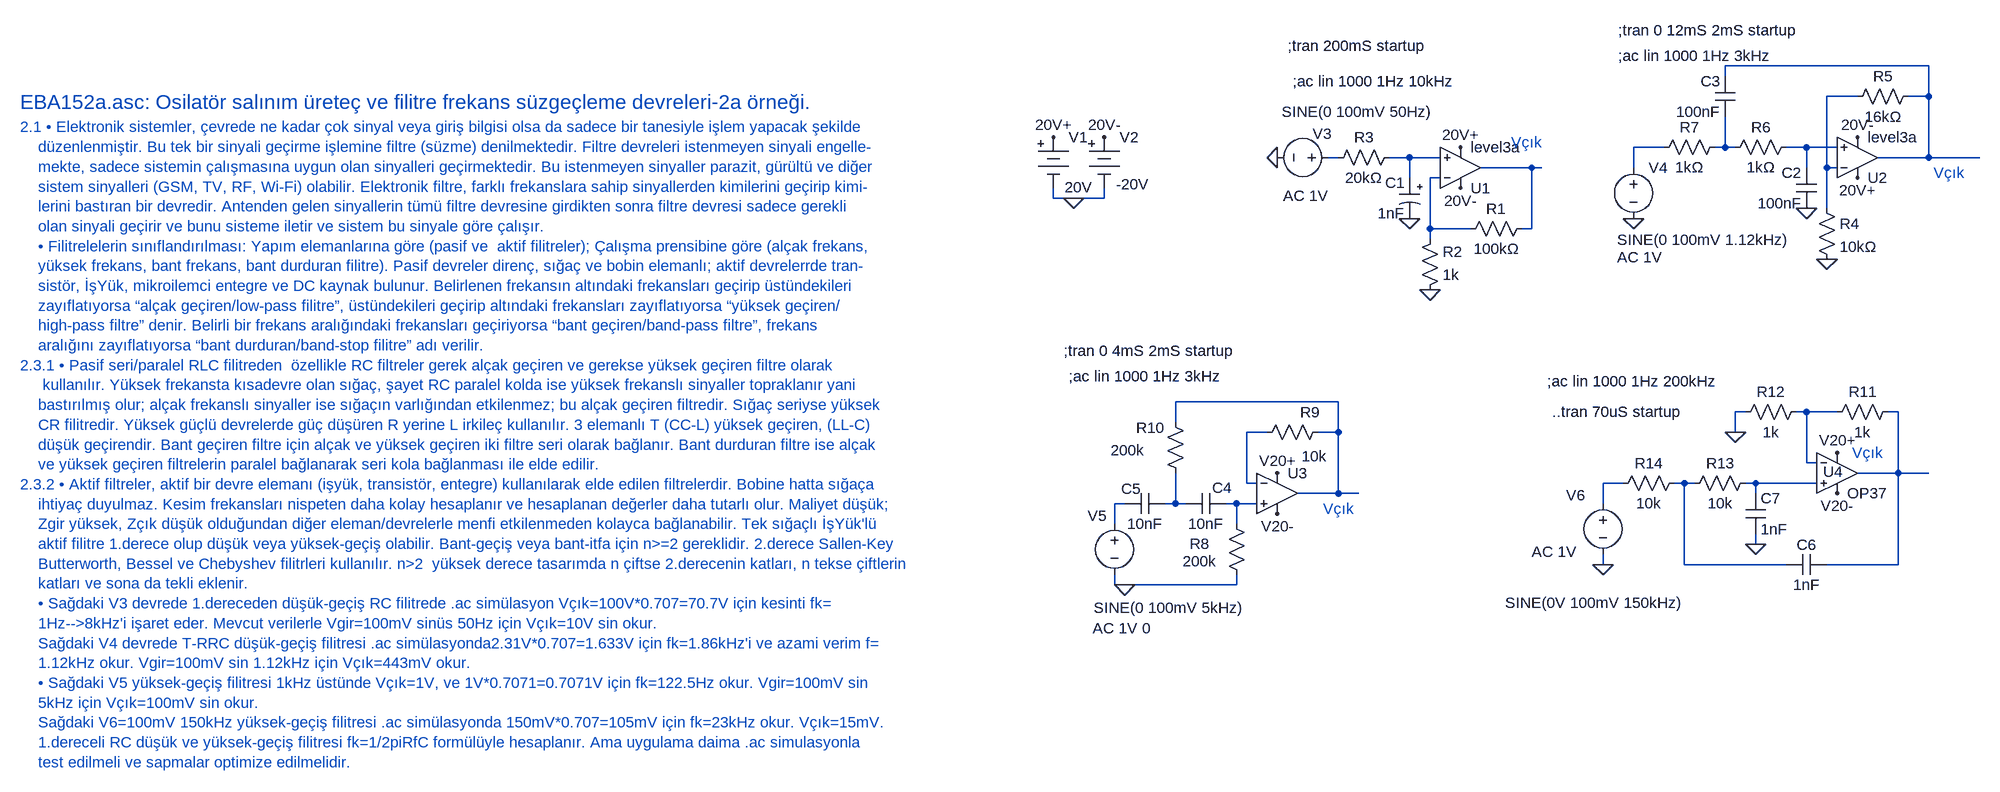
[diagram p0: schematic EBA152a.asc]
EBA152a.asc, the LTspice schematic file:
Version 4
SHEET 1 6044 4332
WIRE 2768 0 2448 0
WIRE 2448 16 2448 0
WIRE 2656 48 2608 48
WIRE 2768 48 2768 0
WIRE 2768 48 2736 48
WIRE 2352 128 2304 128
WIRE 2448 128 2448 80
WIRE 2448 128 2432 128
WIRE 2464 128 2448 128
WIRE 2576 128 2544 128
WIRE 2624 128 2576 128
WIRE 1840 144 1824 144
WIRE 1952 144 1920 144
WIRE 2000 144 1952 144
WIRE 2768 144 2768 48
WIRE 2768 144 2688 144
WIRE 2848 144 2768 144
WIRE 2144 160 2064 160
WIRE 2160 160 2144 160
WIRE 2304 160 2304 128
WIRE 2576 160 2576 128
WIRE 2608 160 2608 48
WIRE 2624 160 2608 160
WIRE 1952 176 1952 144
WIRE 2000 176 1984 176
WIRE 1392 208 1392 192
WIRE 1424 208 1392 208
WIRE 1472 208 1472 192
WIRE 1472 208 1424 208
WIRE 2608 224 2608 160
WIRE 1984 256 1984 176
WIRE 2048 256 1984 256
WIRE 2144 256 2144 160
WIRE 2144 256 2128 256
WIRE 1984 272 1984 256
WIRE 1840 528 1584 528
WIRE 2480 544 2464 544
WIRE 2576 544 2560 544
WIRE 2624 544 2576 544
WIRE 2720 544 2704 544
WIRE 1584 560 1584 528
WIRE 1728 576 1696 576
WIRE 1840 576 1840 528
WIRE 1840 576 1808 576
WIRE 2464 576 2464 544
WIRE 2576 624 2576 544
WIRE 2592 624 2576 624
WIRE 2720 640 2720 544
WIRE 2720 640 2656 640
WIRE 2768 640 2720 640
WIRE 1696 656 1696 576
WIRE 1712 656 1696 656
WIRE 2288 656 2256 656
WIRE 2384 656 2368 656
WIRE 2400 656 2384 656
WIRE 2496 656 2480 656
WIRE 2592 656 2496 656
WIRE 1840 672 1840 576
WIRE 1840 672 1776 672
WIRE 1872 672 1840 672
WIRE 2496 672 2496 656
WIRE 1504 688 1488 688
WIRE 1584 688 1584 640
WIRE 1584 688 1568 688
WIRE 1600 688 1584 688
WIRE 1680 688 1664 688
WIRE 1712 688 1680 688
WIRE 2256 688 2256 656
WIRE 1488 720 1488 688
WIRE 1680 720 1680 688
WIRE 2496 752 2496 736
WIRE 2256 784 2256 768
WIRE 2384 784 2384 656
WIRE 2544 784 2384 784
WIRE 2720 784 2720 640
WIRE 2720 784 2608 784
WIRE 1488 816 1488 800
WIRE 1504 816 1488 816
WIRE 1680 816 1680 800
WIRE 1680 816 1504 816
FLAG 1424 208 0
FLAG 1392 112 20V+
FLAG 1472 112 20V-
FLAG 1984 352 0
FLAG 1952 240 0
FLAG 1744 144 0
FLAG 2656 112 20V-
FLAG 2656 176 20V+
FLAG 2608 304 0
FLAG 2576 224 0
FLAG 2304 240 0
FLAG 1504 816 0
FLAG 1744 640 V20+
FLAG 1744 704 V20-
FLAG 2032 128 20V+
FLAG 2032 192 20V-
FLAG 2464 576 0
FLAG 2256 784 0
FLAG 2496 752 0
FLAG 2624 608 V20+
FLAG 2624 672 V20-
SYMBOL Misc\\battery 1392 96 R0
WINDOW 3 18 95 Left 2
SYMATTR Value 20V
SYMATTR InstName V1
SYMBOL Misc\\battery 1472 96 R0
WINDOW 3 19 90 Left 2
SYMATTR Value -20V
SYMATTR InstName V2
SYMBOL res 2144 240 R90
WINDOW 0 0 56 VBottom 2
WINDOW 3 32 56 VTop 2
SYMATTR InstName R1
SYMATTR Value 100kΩ
SYMBOL res 1968 368 M180
WINDOW 0 36 76 Left 2
WINDOW 3 36 40 Left 2
SYMATTR InstName R2
SYMATTR Value 1k
SYMBOL OpAmps\\UniversalOpAmp3 2032 160 M180
SYMATTR InstName U1
SYMBOL polcap 1968 176 M0
SYMATTR InstName C1
SYMATTR Value 1nF
SYMBOL res 1936 128 R90
WINDOW 0 0 56 VBottom 2
WINDOW 3 32 56 VTop 2
SYMATTR InstName R3
SYMATTR Value 20kΩ
SYMBOL voltage 1840 144 R90
WINDOW 0 -37 11 VRight 2
WINDOW 3 -72 -143 VRight 2
WINDOW 123 60 18 VRight 2
WINDOW 39 0 0 Left 0
SYMATTR InstName V3
SYMATTR Value SINE(0 100mV 50Hz)
SYMATTR Value2 AC 1V
SYMBOL OpAmps\\UniversalOpAmp3 2656 144 M180
SYMATTR InstName U2
SYMBOL res 2592 208 R0
SYMATTR InstName R4
SYMATTR Value 10kΩ
SYMBOL res 2752 32 R90
WINDOW 0 0 56 VBottom 2
WINDOW 3 32 56 VTop 2
SYMATTR InstName R5
SYMATTR Value 16kΩ
SYMBOL cap 2592 160 M0
SYMATTR InstName C2
SYMATTR Value 100nF
SYMBOL res 2560 112 R90
WINDOW 0 0 56 VBottom 2
WINDOW 3 32 56 VTop 2
SYMATTR InstName R6
SYMATTR Value 1kΩ
SYMBOL res 2448 112 R90
WINDOW 0 0 56 VBottom 2
WINDOW 3 32 56 VTop 2
SYMATTR InstName R7
SYMATTR Value 1kΩ
SYMBOL cap 2464 16 M0
SYMATTR InstName C3
SYMATTR Value 100nF
SYMBOL voltage 2304 144 R0
WINDOW 123 -26 157 Left 2
WINDOW 39 0 0 Left 0
WINDOW 3 -26 129 Left 2
SYMATTR Value2 AC 1V
SYMATTR Value SINE(0 100mV 1.12kHz)
SYMATTR InstName V4
SYMBOL voltage 1488 704 R0
WINDOW 0 -42 3 Left 2
WINDOW 123 -34 180 Left 2
WINDOW 39 0 0 Left 0
WINDOW 3 -33 148 Left 2
SYMATTR InstName V5
SYMATTR Value2 AC 1V 0
SYMATTR Value SINE(0 100mV 5kHz)
SYMBOL res 1664 704 R0
WINDOW 0 -58 47 Left 2
WINDOW 3 -69 75 Left 2
SYMATTR InstName R8
SYMATTR Value 200k
SYMBOL cap 1600 704 R270
WINDOW 0 25 57 VTop 2
WINDOW 3 0 32 VBottom 2
SYMATTR InstName C4
SYMATTR Value 10nF
SYMBOL OpAmps\\UniversalOpamp2 1744 672 R0
SYMATTR InstName U3
SYMBOL res 1712 592 R270
WINDOW 0 32 83 VTop 2
WINDOW 3 -6 90 VBottom 2
SYMATTR InstName R9
SYMATTR Value 10k
SYMBOL res 1568 544 R0
WINDOW 0 -46 25 Left 2
WINDOW 3 -86 60 Left 2
SYMATTR InstName R10
SYMATTR Value 200k
SYMBOL cap 1504 704 R270
WINDOW 0 24 10 VTop 2
WINDOW 3 0 32 VBottom 2
SYMATTR InstName C5
SYMATTR Value 10nF
SYMBOL Opamps\\OP37 2624 576 R0
WINDOW 0 -22 62 Left 2
SYMATTR InstName U4
SYMBOL res 2720 528 R90
WINDOW 0 0 56 VBottom 2
WINDOW 3 32 56 VTop 2
SYMATTR InstName R11
SYMATTR Value 1k
SYMBOL res 2576 528 R90
WINDOW 0 0 56 VBottom 2
WINDOW 3 32 56 VTop 2
SYMATTR InstName R12
SYMATTR Value 1k
SYMBOL cap 2608 768 R90
WINDOW 0 0 32 VBottom 2
WINDOW 3 32 32 VTop 2
SYMATTR InstName C6
SYMATTR Value 1nF
SYMBOL res 2496 640 R90
WINDOW 0 0 56 VBottom 2
WINDOW 3 32 56 VTop 2
SYMATTR InstName R13
SYMATTR Value 10k
SYMBOL res 2384 640 R90
WINDOW 0 0 56 VBottom 2
WINDOW 3 32 56 VTop 2
SYMATTR InstName R14
SYMATTR Value 10k
SYMBOL voltage 2256 672 R0
WINDOW 123 -112 92 Left 2
WINDOW 39 0 0 Left 0
WINDOW 0 -58 3 Left 2
WINDOW 3 -154 172 Left 2
SYMATTR Value2 AC 1V
SYMATTR InstName V6
SYMATTR Value SINE(0V 100mV 150kHz)
SYMBOL cap 2480 672 R0
SYMATTR InstName C7
SYMATTR Value 1nF
TEXT -232 56 Left 3 ;EBA152a.asc: Osilatör salınım üreteç ve filitre frekans süzgeçleme devreleri-2a örneği.
TEXT -232 96 Left 2 ;2.1 • Elektronik sistemler, çevrede ne kadar çok sinyal veya giriş bilgisi olsa da sadece bir tanesiyle işlem yapacak şekilde \n    düzenlenmiştir. Bu tek bir sinyali geçirme işlemine filtre (süzme) denilmektedir. Filtre devreleri istenmeyen sinyali engelle-\n    mekte, sadece sistemin çalışmasına uygun olan sinyalleri geçirmektedir. Bu istenmeyen sinyaller parazit, gürültü ve diğer\n    sistem sinyalleri (GSM, TV, RF, Wi-Fi) olabilir. Elektronik filtre, farklı frekanslara sahip sinyallerden kimilerini geçirip kimi-\n    lerini bastıran bir devredir. Antenden gelen sinyallerin tümü filtre devresine girdikten sonra filtre devresi sadece gerekli \n    olan sinyali geçirir ve bunu sisteme iletir ve sistem bu sinyale göre çalışır.\n    • Filitrelelerin sınıflandırılması: Yapım elemanlarına göre (pasif ve  aktif filitreler); Çalışma prensibine göre (alçak frekans,\n    yüksek frekans, bant frekans, bant durduran filitre). Pasif devreler direnç, sığaç ve bobin elemanlı; aktif devrelerrde tran-\n    sistör, İşYük, mikroilemci entegre ve DC kaynak bulunur. Belirlenen frekansın altındaki frekansları geçirip üstündekileri \n    zayıflatıyorsa “alçak geçiren/low-pass filitre”, üstündekileri geçirip altındaki frekansları zayıflatıyorsa “yüksek geçiren/\n    high-pass filtre” denir. Belirli bir frekans aralığındaki frekansları geçiriyorsa “bant geçiren/band-pass filtre”, frekans \n    aralığını zayıflatıyorsa “bant durduran/band-stop filitre” adı verilir.\n2.3.1 • Pasif seri/paralel RLC filitreden  özellikle RC filtreler gerek alçak geçiren ve gerekse yüksek geçiren filtre olarak\n     kullanılır. Yüksek frekansta kısadevre olan sığaç, şayet RC paralel kolda ise yüksek frekanslı sinyaller topraklanır yani \n    bastırılmış olur; alçak frekanslı sinyaller ise sığaçın varlığından etkilenmez; bu alçak geçiren filtredir. Sığaç seriyse yüksek\n    CR filitredir. Yüksek güçlü devrelerde güç düşüren R yerine L irkileç kullanılır. 3 elemanlı T (CC-L) yüksek geçiren, (LL-C)\n    düşük geçirendir. Bant geçiren filtre için alçak ve yüksek geçiren iki filtre seri olarak bağlanır. Bant durduran filtre ise alçak \n    ve yüksek geçiren filtrelerin paralel bağlanarak seri kola bağlanması ile elde edilir.\n2.3.2 • Aktif filtreler, aktif bir devre elemanı (işyük, transistör, entegre) kullanılarak elde edilen filtrelerdir. Bobine hatta sığaça\n    ihtiyaç duyulmaz. Kesim frekansları nispeten daha kolay hesaplanır ve hesaplanan değerler daha tutarlı olur. Maliyet düşük;\n    Zgir yüksek, Zçık düşük olduğundan diğer eleman/devrelerle menfi etkilenmeden kolayca bağlanabilir. Tek sığaçlı İşYük'lü\n    aktif filitre 1.derece olup düşük veya yüksek-geçiş olabilir. Bant-geçiş veya bant-itfa için n>=2 gereklidir. 2.derece Sallen-Key\n    Butterworth, Bessel ve Chebyshev filitrleri kullanılır. n>2  yüksek derece tasarımda n çiftse 2.derecenin katları, n tekse çiftlerin \n    katları ve sona da tekli eklenir.\n    • Sağdaki V3 devrede 1.dereceden düşük-geçiş RC filitrede .ac simülasyon Vçık=100V*0.707=70.7V için kesinti fk=\n    1Hz-->8kHz'i işaret eder. Mevcut verilerle Vgir=100mV sinüs 50Hz için Vçık=10V sin okur.\n    Sağdaki V4 devrede T-RRC düşük-geçiş filitresi .ac simülasyonda2.31V*0.707=1.633V için fk=1.86kHz'i ve azami verim f=\n    1.12kHz okur. Vgir=100mV sin 1.12kHz için Vçık=443mV okur.\n    • Sağdaki V5 yüksek-geçiş filitresi 1kHz üstünde Vçık=1V, ve 1V*0.7071=0.7071V için fk=122.5Hz okur. Vgir=100mV sin \n    5kHz için Vçık=100mV sin okur.\n    Sağdaki V6=100mV 150kHz yüksek-geçiş filitresi .ac simülasyonda 150mV*0.707=105mV için fk=23kHz okur. Vçık=15mV.\n    1.dereceli RC düşük ve yüksek-geçiş filitresi fk=1/2piRfC formülüyle hesaplanır. Ama uygulama daima .ac simulasyonla \n    test edilmeli ve sapmalar optimize edilmelidir.
TEXT 2112 120 Left 2 ;Vçık
TEXT 1768 24 Left 2 !;ac lin 1000 1Hz 10kHz
TEXT 2776 168 Left 2 ;Vçık
TEXT 2280 -16 Left 2 !;ac lin 1000 1Hz 3kHz
TEXT 2280 -56 Left 2 !;tran 0 12mS 2mS startup
TEXT 1760 -32 Left 2 !;tran 200mS startup
TEXT 1416 488 Left 2 !;ac lin 1000 1Hz 3kHz
TEXT 1408 448 Left 2 !;tran 0 4mS 2mS startup
TEXT 1816 696 Left 2 ;Vçık
TEXT 2176 544 Left 2 !..tran 70uS startup
TEXT 2168 496 Left 2 !;ac lin 1000 1Hz 200kHz
TEXT 2648 608 Left 2 ;Vçık

The netlist it stands for:
* EBA152a.asc
V1 20V+ 0 20V
V2 20V- 0 -20V
R1 N008 N009 100kΩ
R2 0 N009 1k
XU1 N007 N009 20V- 20V+ N008 level3a  ; pins In+ In- V+ V- OUT
C1 N007 0 1nF
R3 N007 N006 20kΩ
V3 N006 0 SINE(0 100mV 50Hz) AC 1V
XU2 N005 N002 20V+ 20V- N001 level3a  ; pins In+ In- V+ V- OUT
R4 N002 0 10kΩ
R5 N001 N002 16kΩ
C2 N005 0 100nF
R6 N005 N004 1kΩ
R7 N004 N003 1kΩ
C3 N001 N004 100nF
V4 N003 0 SINE(0 100mV 1.12kHz) AC 1V
V5 N017 0 SINE(0 100mV 5kHz) AC 1V 0
R8 N019 0 200k
C4 N018 N019 10nF
XU3 N019 N013 V20+ V20- N010 level.2 Avol=1Meg GBW=10Meg Slew=10Meg ilimit=25m rail=0 Vos=0 phimargin=45 en=0 enk=0 in=0 ink=0 Rin=500Meg  ; pins IN+ IN- V+ V- OUT
R9 N013 N010 10k
R10 N010 N018 200k
C5 N017 N018 10nF
XU4 N016 N011 V20+ V20- N012 LT1037  ; OP37, pins In+ In- V+ V- OUT
R11 N012 N011 1k
R12 N011 0 1k
C6 N012 N015 1nF
R13 N016 N015 10k
R14 N015 N014 10k
V6 N014 0 SINE(0V 100mV 150kHz) AC 1V
C7 N016 0 1nF
* EBA152a.asc: Osilatör salınım üreteç ve filitre frekans süzgeçleme devreleri-2a örneği.
* 2.1 • Elektronik sistemler, çevrede ne kadar çok sinyal veya giriş bilgisi olsa da sadece bir tanesiyle işlem yapacak şekilde
*     düzenlenmiştir. Bu tek bir sinyali geçirme işlemine filtre (süzme) denilmektedir. Filtre devreleri istenmeyen sinyali engelle-
*     mekte, sadece sistemin çalışmasına uygun olan sinyalleri geçirmektedir. Bu istenmeyen sinyaller parazit, gürültü ve diğer
*     sistem sinyalleri (GSM, TV, RF, Wi-Fi) olabilir. Elektronik filtre, farklı frekanslara sahip sinyallerden kimilerini geçirip kimi-
*     lerini bastıran bir devredir. Antenden gelen sinyallerin tümü filtre devresine girdikten sonra filtre devresi sadece gerekli
*     olan sinyali geçirir ve bunu sisteme iletir ve sistem bu sinyale göre çalışır.
*     • Filitrelelerin sınıflandırılması: Yapım elemanlarına göre (pasif ve  aktif filitreler); Çalışma prensibine göre (alçak frekans,
*     yüksek frekans, bant frekans, bant durduran filitre). Pasif devreler direnç, sığaç ve bobin elemanlı; aktif devrelerrde tran-
*     sistör, İşYük, mikroilemci entegre ve DC kaynak bulunur. Belirlenen frekansın altındaki frekansları geçirip üstündekileri
*     zayıflatıyorsa “alçak geçiren/low-pass filitre”, üstündekileri geçirip altındaki frekansları zayıflatıyorsa “yüksek geçiren/
*     high-pass filtre” denir. Belirli bir frekans aralığındaki frekansları geçiriyorsa “bant geçiren/band-pass filtre”, frekans
*     aralığını zayıflatıyorsa “bant durduran/band-stop filitre” adı verilir.
* 2.3.1 • Pasif seri/paralel RLC filitreden  özellikle RC filtreler gerek alçak geçiren ve gerekse yüksek geçiren filtre olarak
*      kullanılır. Yüksek frekansta kısadevre olan sığaç, şayet RC paralel kolda ise yüksek frekanslı sinyaller topraklanır yani
*     bastırılmış olur; alçak frekanslı sinyaller ise sığaçın varlığından etkilenmez; bu alçak geçiren filtredir. Sığaç seriyse yüksek
*     CR filitredir. Yüksek güçlü devrelerde güç düşüren R yerine L irkileç kullanılır. 3 elemanlı T (CC-L) yüksek geçiren, (LL-C)
*     düşük geçirendir. Bant geçiren filtre için alçak ve yüksek geçiren iki filtre seri olarak bağlanır. Bant durduran filtre ise alçak
*     ve yüksek geçiren filtrelerin paralel bağlanarak seri kola bağlanması ile elde edilir.
* 2.3.2 • Aktif filtreler, aktif bir devre elemanı (işyük, transistör, entegre) kullanılarak elde edilen filtrelerdir. Bobine hatta sığaça
*     ihtiyaç duyulmaz. Kesim frekansları nispeten daha kolay hesaplanır ve hesaplanan değerler daha tutarlı olur. Maliyet düşük;
*     Zgir yüksek, Zçık düşük olduğundan diğer eleman/devrelerle menfi etkilenmeden kolayca bağlanabilir. Tek sığaçlı İşYük'lü
*     aktif filitre 1.derece olup düşük veya yüksek-geçiş olabilir. Bant-geçiş veya bant-itfa için n>=2 gereklidir. 2.derece Sallen-Key
*     Butterworth, Bessel ve Chebyshev filitrleri kullanılır. n>2  yüksek derece tasarımda n çiftse 2.derecenin katları, n tekse çiftlerin
*     katları ve sona da tekli eklenir.
*     • Sağdaki V3 devrede 1.dereceden düşük-geçiş RC filitrede .ac simülasyon Vçık=100V*0.707=70.7V için kesinti fk=
*     1Hz-->8kHz'i işaret eder. Mevcut verilerle Vgir=100mV sinüs 50Hz için Vçık=10V sin okur.
*     Sağdaki V4 devrede T-RRC düşük-geçiş filitresi .ac simülasyonda2.31V*0.707=1.633V için fk=1.86kHz'i ve azami verim f=
*     1.12kHz okur. Vgir=100mV sin 1.12kHz için Vçık=443mV okur.
*     • Sağdaki V5 yüksek-geçiş filitresi 1kHz üstünde Vçık=1V, ve 1V*0.7071=0.7071V için fk=122.5Hz okur. Vgir=100mV sin
*     5kHz için Vçık=100mV sin okur.
*     Sağdaki V6=100mV 150kHz yüksek-geçiş filitresi .ac simülasyonda 150mV*0.707=105mV için fk=23kHz okur. Vçık=15mV.
*     1.dereceli RC düşük ve yüksek-geçiş filitresi fk=1/2piRfC formülüyle hesaplanır. Ama uygulama daima .ac simulasyonla
*     test edilmeli ve sapmalar optimize edilmelidir.
* Vçık
;ac lin 1000 1Hz 10kHz
* Vçık
;ac lin 1000 1Hz 3kHz
;tran 0 12mS 2mS startup
;tran 200mS startup
;ac lin 1000 1Hz 3kHz
;tran 0 4mS 2mS startup
* Vçık
..tran 70uS startup
;ac lin 1000 1Hz 200kHz
* Vçık
.lib UniversalOpamps2.sub
.lib LTC.lib
.backanno
.end